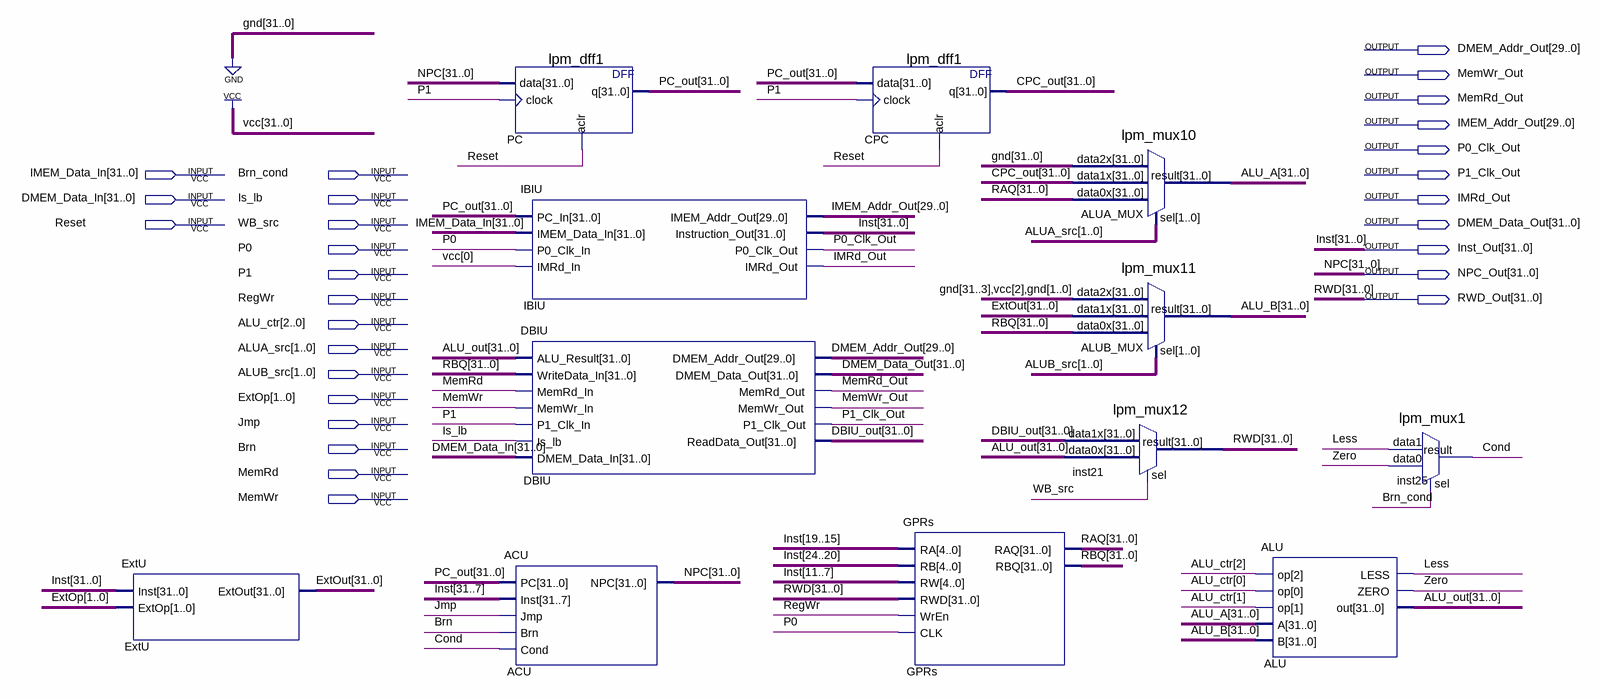
[diagram p0: schematic sheet]
// Quartus schematic DataPath.bdf as structural Verilog: 12 symbols, 28 pins
module DataPath (
  input  [31:0] IMEM_Data_In,
  input  Brn_cond,
  input  [31:0] DMEM_Data_In,
  input  Is_lb,
  input  Reset,
  input  WB_src,
  input  P0,
  input  P1,
  input  RegWr,
  input  [2:0] ALU_ctr,
  input  [1:0] ALUA_src,
  input  [1:0] ALUB_src,
  input  [1:0] ExtOp,
  input  Jmp,
  input  Brn,
  input  MemRd,
  input  MemWr,
  output [29:0] DMEM_Addr_Out,
  output MemWr_Out,
  output MemRd_Out,
  output [29:0] IMEM_Addr_Out,
  output P0_Clk_Out,
  output P1_Clk_Out,
  output IMRd_Out,
  output [31:0] DMEM_Data_Out,
  output [31:0] Inst_Out,
  output [31:0] NPC_Out,
  output [31:0] RWD_Out
);

  wire Cond, Less, Zero;
  wire [31:0] ALU_A, ALU_B, ALU_out, CPC_out, DBIU_out, ExtOut, PC_out, RAQ, RBQ;

  ExtU ExtU (.Inst(Inst_Out), .ExtOp(ExtOp), .ExtOut(ExtOut));
  lpm_dff1 PC (.data(NPC_Out), .clock(P1), .aclr(Reset), .q(PC_out));
  ACU ACU (.PC(PC_out), .Inst(Inst_Out[31:7]), .Jmp(Jmp), .Brn(Brn), .Cond(Cond), .NPC(NPC_Out));
  IBIU IBIU (
    .PC_In(PC_out), .IMEM_Data_In(IMEM_Data_In), .P0_Clk_In(P0), .IMRd_In(1'b1),
    .IMEM_Addr_Out(IMEM_Addr_Out), .Instruction_Out(Inst_Out), .P0_Clk_Out(P0_Clk_Out), .IMRd_Out(IMRd_Out));
  DBIU DBIU (
    .ALU_Result(ALU_out), .WriteData_In(RBQ), .MemRd_In(MemRd), .MemWr_In(MemWr), .P1_Clk_In(P1),
    .Is_lb(Is_lb), .DMEM_Data_In(DMEM_Data_In), .DMEM_Addr_Out(DMEM_Addr_Out), .DMEM_Data_Out(DMEM_Data_Out),
    .MemRd_Out(MemRd_Out), .MemWr_Out(MemWr_Out), .P1_Clk_Out(P1_Clk_Out), .ReadData_Out(DBIU_out));
  lpm_dff1 CPC (.data(PC_out), .clock(P1), .aclr(Reset), .q(CPC_out));
  GPRs GPRs (
    .RA(Inst_Out[19:15]), .RB(Inst_Out[24:20]), .RW(Inst_Out[11:7]), .RWD(RWD_Out), .WrEn(RegWr), .CLK(P0),
    .RAQ(RAQ), .RBQ(RBQ));
  lpm_mux10 ALUA_MUX (.data2x({32{1'b0}}), .data1x(CPC_out), .data0x(RAQ), .sel(ALUA_src), .result(ALU_A));
  lpm_mux11 ALUB_MUX (
    .data2x(32'b00000000000000000000000000000100), .data1x(ExtOut), .data0x(RBQ), .sel(ALUB_src),
    .result(ALU_B));
  lpm_mux12 inst21 (.data1x(DBIU_out), .data0x(ALU_out), .sel(WB_src), .result(RWD_Out));
  ALU ALU (.op(ALU_ctr), .A(ALU_A), .B(ALU_B), .LESS(Less), .ZERO(Zero), .out(ALU_out));
  lpm_mux1 inst25 (.data1(Less), .data0(Zero), .sel(Brn_cond), .result(Cond));

  // Other names for the same wires on the sheet: Inst[31:0] = Inst_Out; NPC[31:0] = NPC_Out; RWD[31:0] = RWD_Out
endmodule
